# Altium schematic sheet SG_Amplifiers_LTC2053(350).SchDoc
size A
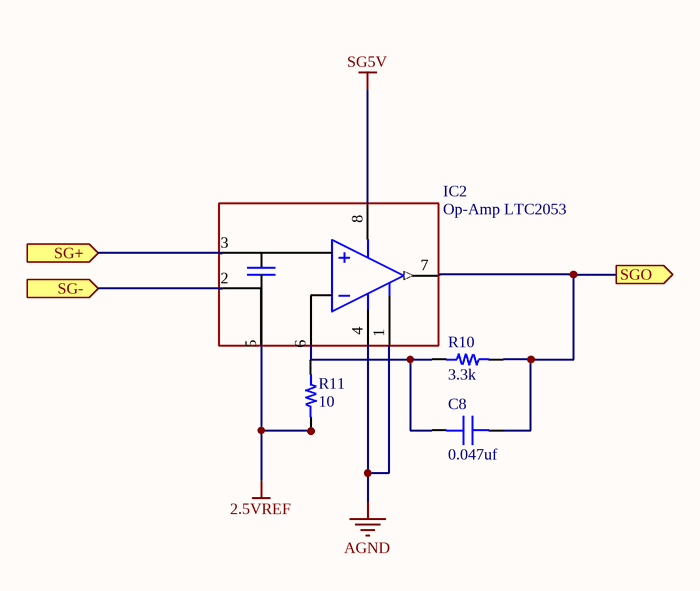
[diagram p0: SG_Amplifiers_LTC2053(350).SchDoc]

## Parts
C8  value 0.047uf  [CAP 0603/1608]  (hidden comment: Capacitor MLCC 0.047uf 50V CAP 0603/1608)
IC2  Op-Amp LTC2053  [MSOP-8]
R10  value 3.3k  [RES 0603/1608]  (hidden comment: Resistor 3.3k 0603 1/10W 5%)
R11  value 10  [RES 0603/1608]  (hidden comment: Resistor 10 0603 1/10W 1%)

## Ports
SG+ (in), SG- (in), SGO (out)

## Nets
2.5VREF: IC2.5(REF) R11.1
AGND: IC2.1 IC2.4(V-)
SG5V: IC2.8(V+)
SG+: IC2.3(+IN) ; port SG+
SG-: IC2.2(-IN) ; port SG-
SGO: C8.2 IC2.7(OUT) R10.2 ; port SGO
NetC8_1: C8.1 IC2.6(RG) R10.1 R11.2

## Library data of the parts
C8 = 941: Manufacturer_id: 1; idCapacitor: 941; Name: Cap_0.047uf_50V_CAP 0603/1608; Dielectric: Ceramic; Created_By: Nick Mah; Drawer_id: 1; Voltage_Rating: 50V; Package: CAP 0603/1608; Created_Date: 10/20/2018
IC2 = 2: Manufacturer_id: 1; idOp_Amp: 2; Name: Instrumentation Amplifier; Amplifier_Type: Instrumentation; Supply_Voltage: 2.7V to ±5.5V; Created_By: Angel Delgado; Drawer_id: 1; Num_Circuits: 1; Package: MSOP8; MfrPartNo: LTC2053; Link: https://www.digikey.com/product-detail/en/linear-technology-analog-devices/LTC2053CMS8-TRPBF/LTC2053CMS8-TRPBFCT-ND/5892339
R10 = 1381: Manufacturer_id: 1; idResistor: 1381; Name: Res_3.3k_0603_1/10W_5%; Created_By: Nick Mah; Supplier 1: Digi-Key; Drawer_id: 1; Tolerance: 5%; Power: 1/10W; Package: 0603; ComponentLink1Description: Datasheet; Created_Date: 2018-10-20
R11 = 241: Manufacturer_id: 1; idResistor: 241; Name: Res_10_0603_1/10W_1%; Created_By: Nick Mah; Supplier 1: Digi-Key; Drawer_id: 1; Tolerance: 1%; Power: 1/10W; Package: 0603; ComponentLink1Description: Datasheet; Created_Date: 2018-10-20